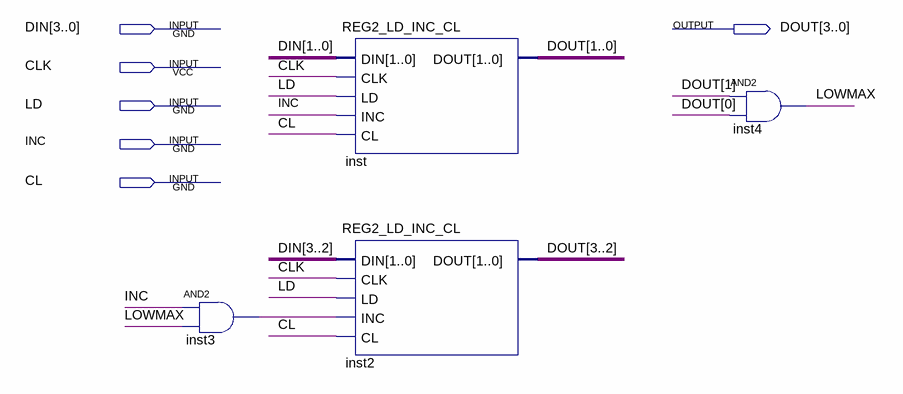
[diagram p0: schematic sheet]
// Quartus schematic REG4_LD_INC_CL.bdf as structural Verilog: 4 symbols, 6 pins
module REG4_LD_INC_CL (
  input  [3:0] DIN,
  input  CLK,
  input  LD,
  input  INC,
  input  CL,
  output [3:0] DOUT
);

  wire inst3_out, LOWMAX;

  and inst3 (inst3_out, INC, LOWMAX);
  REG2_LD_INC_CL inst (.DIN(DIN[1:0]), .CLK(CLK), .LD(LD), .INC(INC), .CL(CL), .DOUT(DOUT[1:0]));
  REG2_LD_INC_CL inst2 (.DIN(DIN[3:2]), .CLK(CLK), .LD(LD), .INC(inst3_out), .CL(CL), .DOUT(DOUT[3:2]));
  and inst4 (LOWMAX, DOUT[1], DOUT[0]);
endmodule
